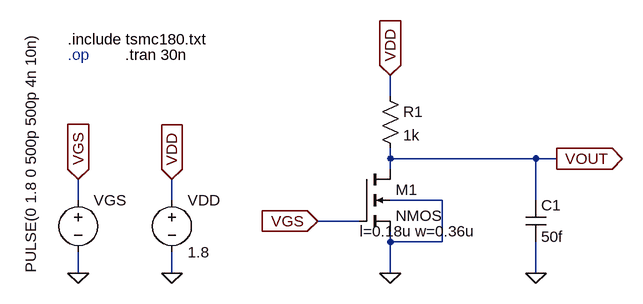
[diagram p0: schematic NMOS_strong0_weak1.asc]
NMOS_strong0_weak1.asc, the LTspice schematic file:
Version 4
SHEET 1 880 680
WIRE 432 64 432 32
WIRE 432 160 432 144
WIRE 656 160 432 160
WIRE 688 160 656 160
WIRE 432 176 432 160
WIRE -48 224 -48 192
WIRE 96 224 96 192
WIRE 512 224 432 224
WIRE 656 224 656 160
WIRE 384 256 320 256
WIRE 432 288 432 272
WIRE 512 288 512 224
WIRE 512 288 432 288
WIRE -48 336 -48 304
WIRE 96 336 96 304
WIRE 432 336 432 288
WIRE 656 336 656 288
FLAG 432 336 0
FLAG 96 336 0
FLAG -48 336 0
FLAG 320 256 VGS
IOPIN 320 256 In
FLAG 96 192 VDD
IOPIN 96 192 In
FLAG 432 32 VDD
IOPIN 432 32 In
FLAG -48 192 VGS
IOPIN -48 192 In
FLAG 688 160 VOUT
IOPIN 688 160 Out
FLAG 656 336 0
SYMBOL nmos4 384 176 R0
WINDOW 123 1 96 Left 2
SYMATTR InstName M1
SYMATTR Value2 l=0.18u w=0.36u
SYMBOL voltage 96 208 R0
WINDOW 123 0 0 Left 0
WINDOW 39 0 0 Left 0
SYMATTR InstName VDD
SYMATTR Value 1.8
SYMBOL voltage -48 208 R0
WINDOW 3 -73 -243 VRight 2
WINDOW 123 0 0 Left 0
WINDOW 39 0 0 Left 0
SYMATTR InstName VGS
SYMATTR Value PULSE(0 1.8 0 500p 500p 4n 10n)
SYMBOL res 416 48 R0
SYMATTR InstName R1
SYMATTR Value 1k
SYMBOL cap 640 224 R0
SYMATTR InstName C1
SYMATTR Value 50f
TEXT -64 -24 Left 2 !.include tsmc180.txt
TEXT -64 0 Left 2 ;.op
TEXT 24 0 Left 2 !.tran 30n

The netlist it stands for:
* NMOS_strong0_weak1.asc
M1 VOUT VGS 0 0 NMOS l=0.18u w=0.36u
VDD VDD 0 1.8
VGS VGS 0 PULSE(0 1.8 0 500p 500p 4n 10n)
R1 VDD VOUT 1k
C1 VOUT 0 50f
.model NMOS NMOS
.model PMOS PMOS
.lib standard.mos
.include tsmc180.txt
* .op
.tran 30n
.backanno
.end